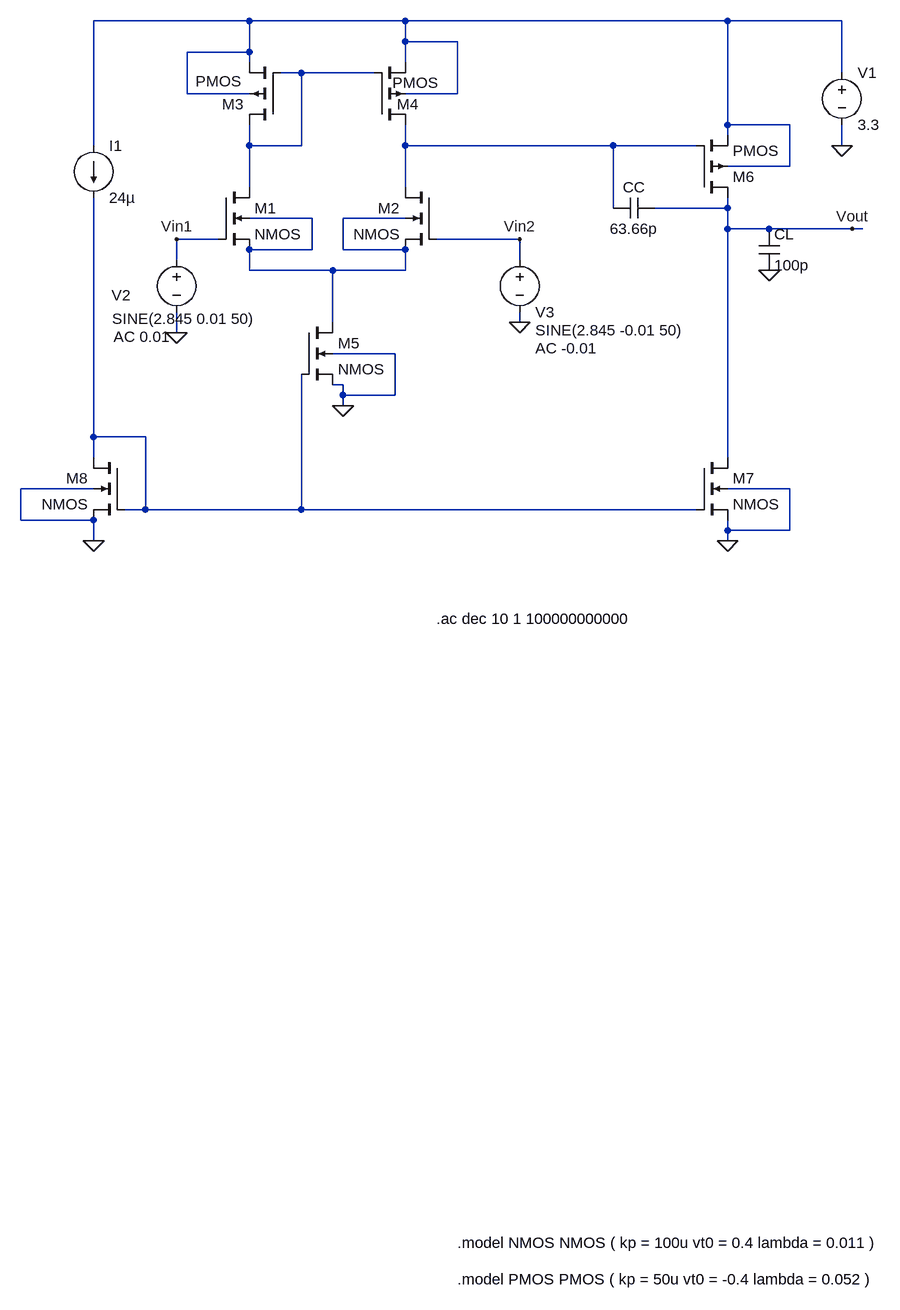
[diagram p0: schematic LTSpice Schematic - 2 Stage Op-Amp - 복사본.asc]
LTSpice Schematic - 2 Stage Op-Amp - 복사본.asc, the LTspice schematic file:
Version 4
SHEET 1 2416 1792
WIRE 144 -160 -96 -160
WIRE 384 -160 144 -160
WIRE 880 -160 384 -160
WIRE 1056 -160 880 -160
WIRE 384 -128 384 -160
WIRE 464 -128 384 -128
WIRE 144 -112 144 -160
WIRE 144 -112 48 -112
WIRE 144 -96 144 -112
WIRE 384 -96 384 -128
WIRE 224 -80 192 -80
WIRE 336 -80 224 -80
WIRE 1056 -80 1056 -160
WIRE 48 -48 48 -112
WIRE 144 -48 48 -48
WIRE 464 -48 464 -128
WIRE 464 -48 384 -48
WIRE 880 0 880 -160
WIRE 976 0 880 0
WIRE 880 16 880 0
WIRE -96 32 -96 -160
WIRE 144 32 144 0
WIRE 224 32 224 -80
WIRE 224 32 144 32
WIRE 384 32 384 0
WIRE 704 32 384 32
WIRE 832 32 704 32
WIRE 1056 32 1056 0
WIRE 976 64 976 0
WIRE 976 64 880 64
WIRE 144 96 144 32
WIRE 384 96 384 32
WIRE 704 128 704 32
WIRE 880 128 880 112
WIRE 880 128 768 128
WIRE 240 144 144 144
WIRE 384 144 288 144
WIRE 880 160 880 128
WIRE 944 160 880 160
WIRE 1072 160 944 160
WIRE 1088 160 1072 160
WIRE 96 176 32 176
WIRE 560 176 432 176
WIRE 240 192 240 144
WIRE 240 192 144 192
WIRE 288 192 288 144
WIRE 384 192 288 192
WIRE 32 208 32 176
WIRE 560 208 560 176
WIRE 144 224 144 192
WIRE 272 224 144 224
WIRE 384 224 384 192
WIRE 384 224 272 224
WIRE 272 304 272 224
WIRE 560 304 560 288
WIRE 32 320 32 288
WIRE 368 352 272 352
WIRE 288 400 272 400
WIRE 288 416 288 400
WIRE 368 416 368 352
WIRE 368 416 288 416
WIRE 288 432 288 416
WIRE -96 480 -96 112
WIRE -16 480 -96 480
WIRE -96 512 -96 480
WIRE 880 512 880 160
WIRE -96 560 -208 560
WIRE 976 560 880 560
WIRE -16 592 -16 480
WIRE -16 592 -48 592
WIRE 224 592 224 384
WIRE 224 592 -16 592
WIRE 832 592 224 592
WIRE -208 608 -208 560
WIRE -96 608 -208 608
WIRE 880 624 880 608
WIRE 976 624 976 560
WIRE 976 624 880 624
WIRE -96 640 -96 608
WIRE 880 640 880 624
FLAG 1056 32 0
FLAG 32 320 0
FLAG 560 304 0
FLAG 944 224 0
FLAG 1072 160 Vout
FLAG -96 640 0
FLAG 288 432 0
FLAG 880 640 0
FLAG 32 176 Vin1
FLAG 560 176 Vin2
SYMBOL nmos4 96 96 R0
SYMATTR InstName M1
SYMATTR Value2 l=1620n w=16.2m
SYMBOL nmos4 224 304 R0
SYMATTR InstName M5
SYMATTR Value2 l=1620n w=2203.83n
SYMBOL nmos4 -48 512 M0
SYMATTR InstName M8
SYMATTR Value2 l=2430n w=198.288n
SYMBOL current -96 32 R0
WINDOW 123 0 0 Left 2
WINDOW 39 0 0 Left 2
SYMATTR InstName I1
SYMATTR Value 24µ
SYMBOL pmos4 192 0 R180
WINDOW 3 60 67 Left 2
SYMATTR InstName M3
SYMATTR Value2 l=520n w=1661.52u
SYMBOL pmos4 336 0 M180
WINDOW 0 35 32 Left 2
WINDOW 3 28 65 Left 2
SYMATTR InstName M4
SYMATTR Value2 l=520n w=1661.52u
SYMBOL voltage 1056 -96 R0
WINDOW 123 0 0 Left 2
WINDOW 39 0 0 Left 2
SYMATTR InstName V1
SYMATTR Value 3.3
SYMBOL voltage 32 192 R0
WINDOW 123 -97 134 Left 2
WINDOW 39 0 0 Left 2
WINDOW 3 -99 106 Left 2
WINDOW 0 -100 70 Left 2
SYMATTR Value2 AC 0.01
SYMATTR Value SINE(2.845 0.01 50)
SYMATTR InstName V2
SYMBOL nmos4 432 96 M0
SYMATTR InstName M2
SYMATTR Value2 l=1620n w=16.2m
SYMBOL voltage 560 192 R0
WINDOW 0 24 96 Left 2
WINDOW 3 24 124 Left 2
WINDOW 123 24 152 Left 2
WINDOW 39 0 0 Left 2
SYMATTR InstName V3
SYMATTR Value SINE(2.845 -0.01 50)
SYMATTR Value2 AC -0.01
SYMBOL pmos4 832 112 M180
SYMATTR InstName M6
SYMATTR Value2 l=520n w=16.61m
SYMBOL nmos4 832 512 R0
SYMATTR InstName M7
SYMATTR Value2 l=1620n w=11.016u
SYMBOL cap 928 160 R0
SYMATTR InstName CL
SYMATTR Value 100p
SYMBOL cap 768 112 R90
WINDOW 0 0 32 VBottom 2
WINDOW 3 32 32 VTop 2
SYMATTR InstName CC
SYMATTR Value 63.66p
TEXT 432 760 Left 2 !.ac dec 10 1 100000000000
TEXT 464 1720 Left 2 !.model NMOS NMOS ( kp = 100u vt0 = 0.4 lambda = 0.011 )
TEXT 464 1776 Left 2 !.model PMOS PMOS ( kp = 50u vt0 = -0.4 lambda = 0.052 )

The netlist it stands for:
* LTSpice Schematic - 2 Stage Op-Amp - 복사본.asc
M1 N002 Vin1 N004 N004 NMOS l=1620n w=16.2m
M5 N004 N005 0 0 NMOS l=1620n w=2203.83n
M8 N005 N005 0 0 NMOS l=2430n w=198.288n
I1 N001 N005 24µ
M3 N002 N002 N001 N001 PMOS l=520n w=1661.52u
M4 N003 N002 N001 N001 PMOS l=520n w=1661.52u
V1 N001 0 3.3
V2 Vin1 0 SINE(2.845 0.01 50) AC 0.01
M2 N003 Vin2 N004 N004 NMOS l=1620n w=16.2m
V3 Vin2 0 SINE(2.845 -0.01 50) AC -0.01
M6 Vout N003 N001 N001 PMOS l=520n w=16.61m
M7 Vout N005 0 0 NMOS l=1620n w=11.016u
CL Vout 0 100p
CC Vout N003 63.66p
.model NMOS NMOS
.model PMOS PMOS
.lib standard.mos
.ac dec 10 1 100000000000
.model NMOS NMOS ( kp = 100u vt0 = 0.4 lambda = 0.011 )
.model PMOS PMOS ( kp = 50u vt0 = -0.4 lambda = 0.052 )
.backanno
.end